# Altium project Wireless_Security_Detection.PrjPcb (part 2 of 3)

## Sheet Microcontroller.SchDoc
size A3; SheetNumber: 3; SheetTotal: 4; Size: A3
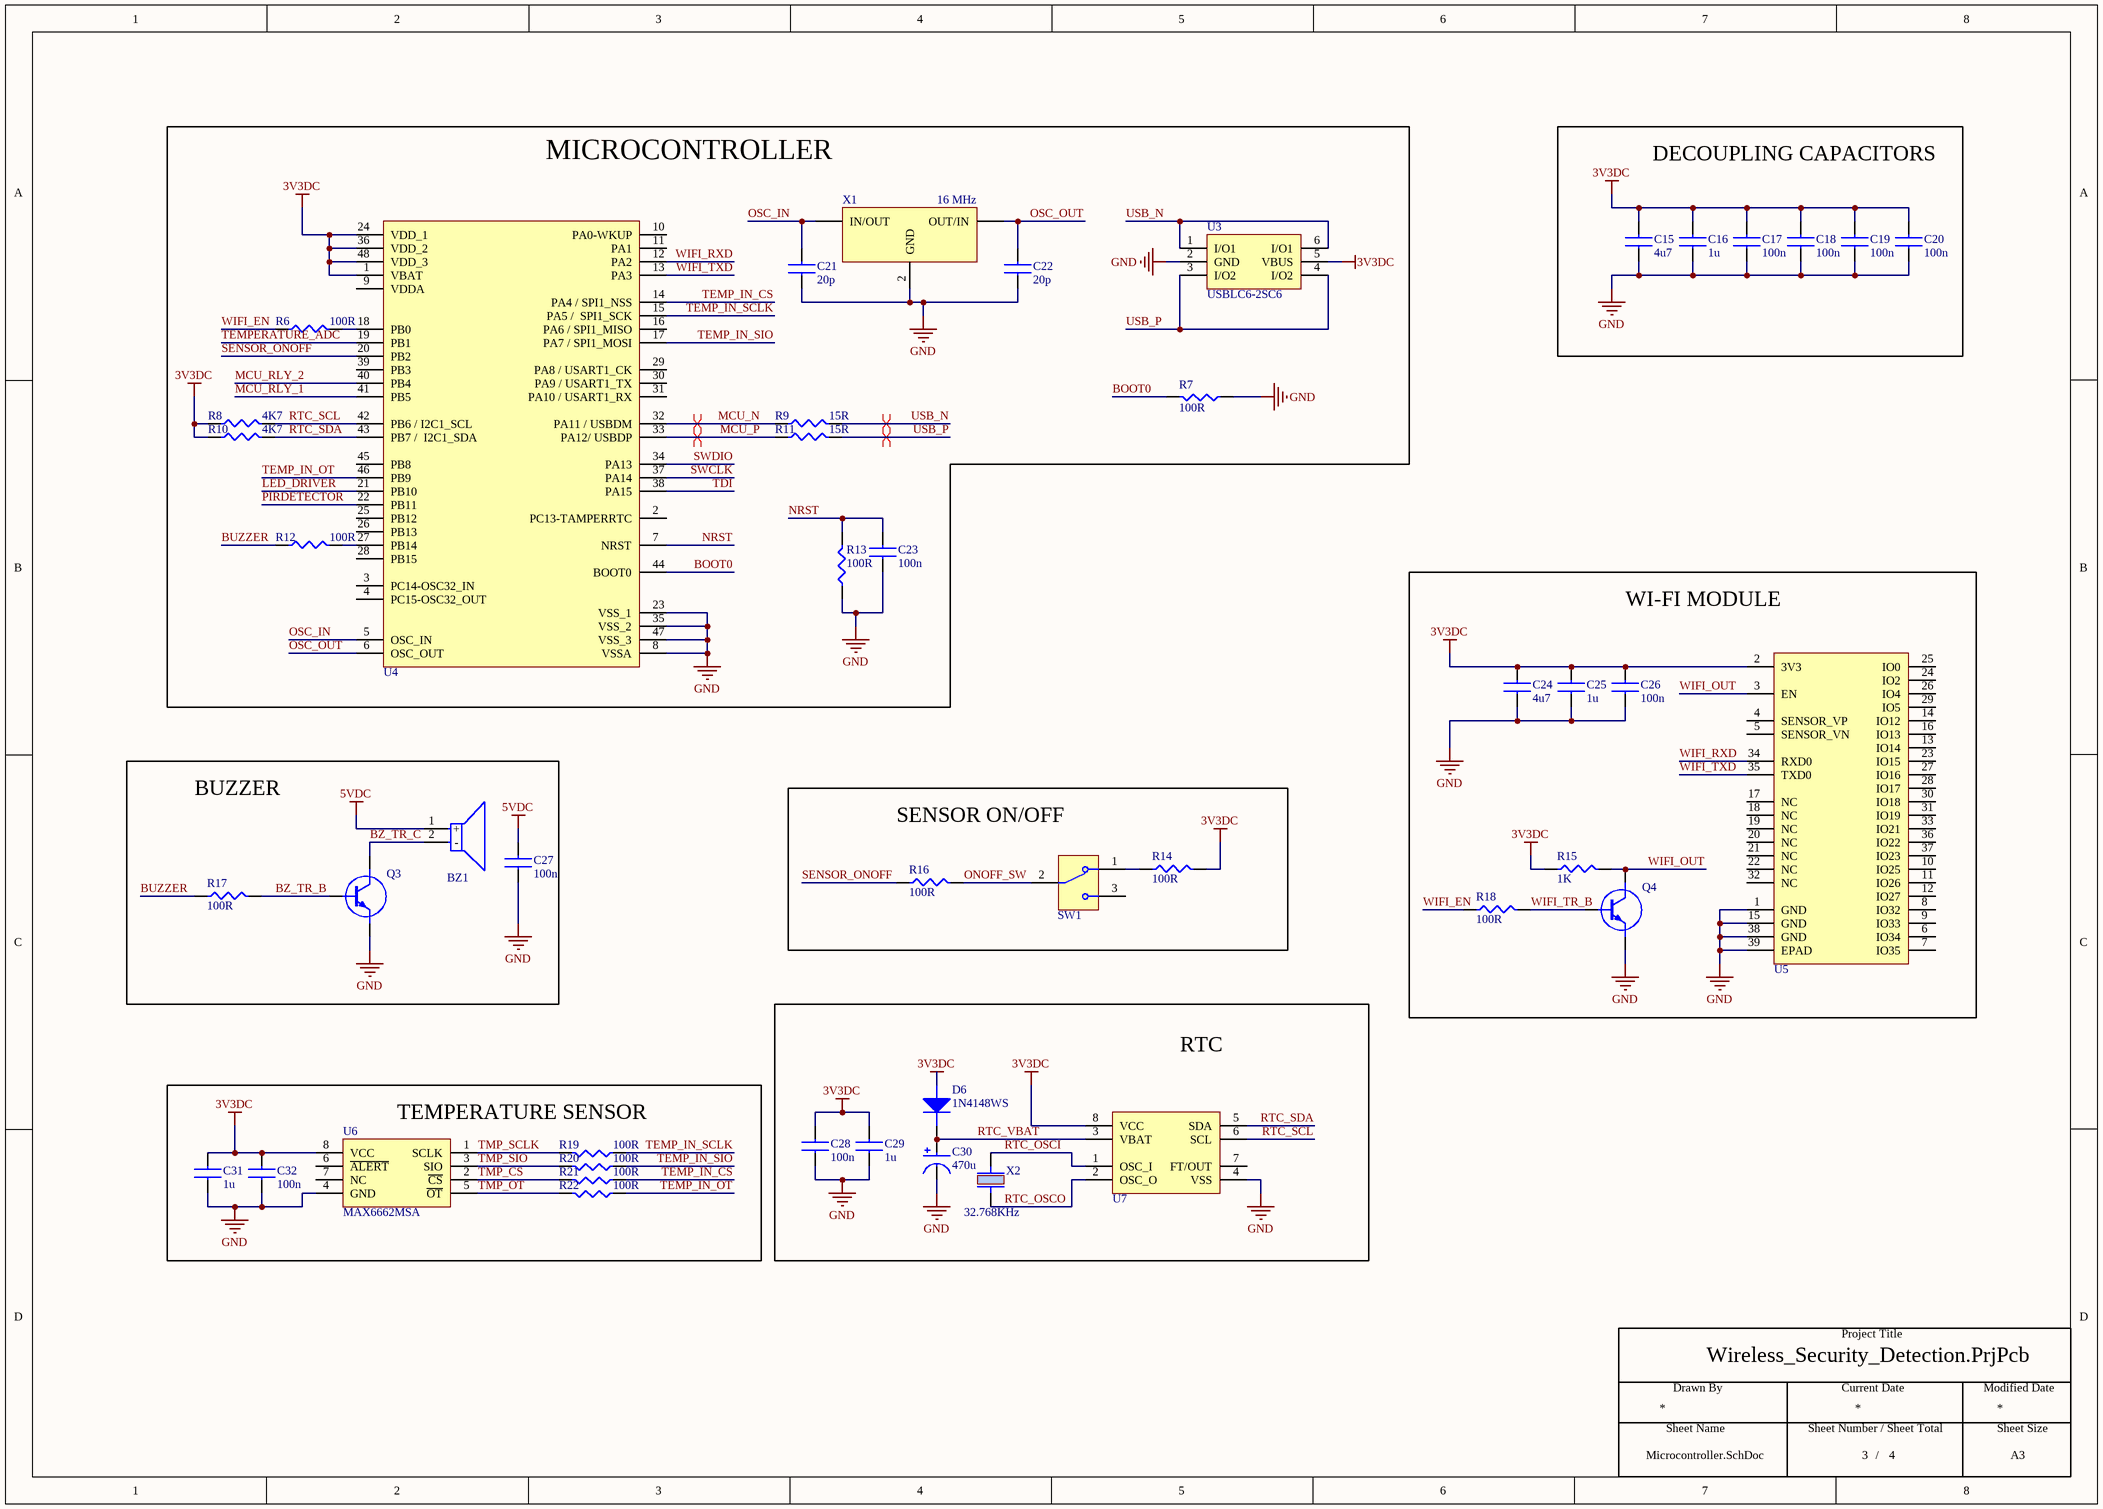
[diagram p2: Microcontroller.SchDoc]

### Parts
BZ1  CMI-9605IC-0580T  [CMI-9605IC-0580T]  (value not drawn)
C15  4u7  [CAPACITOR 0805 - duplicate]
C16  1u  [CAPACITOR 0805 - duplicate]
C17  100n  [Capacitor 0603]
C18  100n  [Capacitor 0603]
C19  100n  [Capacitor 0603]
C20  100n  [Capacitor 0603]
C21  20p  [CAPACITOR 0603]
C22  20p  [CAPACITOR 0603]
C23  100n  [CAPACITOR 0805 - duplicate]
C24  4u7  [CAPACITOR 0805 - duplicate]
C25  1u  [CAPACITOR 0805 - duplicate]
C26  100n  [CAPACITOR 0805 - duplicate]
C27  100n  [CAPACITOR 0805 - duplicate]
C28  100n  [CAPACITOR 0805 - duplicate]
C29  1u  [CAPACITOR 0805 - duplicate]
C30  470u  [CAP ALUM RADIAL TH D10 L20 P5]
C31  1u  [CAPACITOR 0805 - duplicate]
C32  100n  [CAPACITOR 0805 - duplicate]
D6  1N4148WS  [SOD-323F]
Q3  MMBT3904-7-F  [SOT-23F]  (value not drawn)
Q4  MMBT3904-7-F  [SOT-23F]  (value not drawn)
R6  100R  [Resistor 0603]
R7  100R  [Resistor 0603]
R8  4K7  [Resistor 0603]
R9  15R  [Resistor 0603]
R10  4K7  [Resistor 0603]
R11  15R  [Resistor 0603]
R12  100R  [Resistor 0603]
R13  100R  [Resistor 0603]
R14  100R  [Resistor 0603]
R15  1K  [Resistor 0603]
R16  100R  [Resistor 0603]
R17  100R  [Resistor 0603]
R18  100R  [Resistor 0603]
R19  100R  [Resistor 0603]
R20  100R  [Resistor 0603]
R21  100R  [Resistor 0603]
R22  100R  [Resistor 0603]
SW1  EG1215AA  [EG1215AA]  (value not drawn)
U3  USBLC6-2SC6  [SOT23-6L]
U4  STM32F103C6T6A  [LQFP48]  (value not drawn)
U5  ESP32-WROOM-32E  [ESP32­WROOM­32E]  (value not drawn)
U6  MAX6662MSA  [SOIC-8]
U7  M41T00M6F  [SOIC-8]  (value not drawn)
X1  16 MHz  [ECS-160-20-30B-TR 16MHZ]
X2  32.768KHz  [ABS05-32.768KHZ-T]

### Blocks framed on the sheet
MICROCONTROLLER: C21-C23 R6-R13 U3 U4 X1
DECOUPLING CAPACITORS: C15-C20
WI-FI MODULE: C24-C26 Q4 R15 R18 U5
BUZZER: BZ1 C27 Q3 R17
SENSOR ON/OFF: R14 R16 SW1
RTC: C28-C30 D6 U7 X2
TEMPERATURE SENSOR: C31 C32 R19-R22 U6

### Nets
3V3DC: C15.2 C16.2 C17.2 C18.2 C19.2 C20.2 C24.2 C25.2 C26.2 C28.2 C29.2 C31.2 C32.2 D6.1(A) R8.1 R10.1 R14.2 R15.1 U3.5(VBUS) U4.1(VBAT) U4.24(VDD_1) U4.36(VDD_2) U4.48(VDD_3) U5.2(3V3) U6.8(VCC) U7.8(VCC)
5VDC: BZ1.1(+) C27.2
GND: C15.1 C16.1 C17.1 C18.1 C19.1 C20.1 C21.1 C22.1 C23.1 C24.1 C25.1 C26.1 C27.1 C28.1 C29.1 C30.2 C31.1 C32.1 Q3.2(E) Q4.2(E) R7.1 R13.1 U3.2(GND) U4.8(VSSA) U4.23(VSS_1) U4.35(VSS_2) U4.47(VSS_3) U5.1(GND) U5.15(GND) U5.38(GND) U5.39(EPAD) U6.4(GND) U7.4(VSS) X1.2(GND)
BOOT0: R7.2 U4.44(BOOT0)
BUZZER: R12.1 R17.1
BZ_TR_B: Q3.1(B) R17.2
BZ_TR_C: BZ1.2(-) Q3.3(C)
LED_DRIVER: U4.21(PB10)
MCU_N: R9.1 U4.32(PA11_/_USBDM)
MCU_P: R11.1 U4.33(PA12/_USBDP)
MCU_RLY_1: U4.41(PB5)
MCU_RLY_2: U4.40(PB4)
NRST: C23.2 R13.2 U4.7(NRST)
ONOFF_SW: R16.2 SW1.2
OSC_IN: C21.2 U4.5(OSC_IN) X1.1(IN/OUT)
OSC_OUT: C22.2 U4.6(OSC_OUT) X1.3(OUT/IN)
PIRDETECTOR: U4.22(PB11)
RTC_OSCI: U7.1(OSC_I) X2.2
RTC_OSCO: U7.2(OSC_O) X2.1
RTC_SCL: R8.2 U4.42(PB6_/_I2C1_SCL) U7.6(SCL)
RTC_SDA: R10.2 U4.43(PB7_/__I2C1_SDA) U7.5(SDA)
RTC_VBAT: C30.1 D6.2(C) U7.3(VBAT)
SENSOR_ONOFF: R16.1 U4.20(PB2)
SWCLK: U4.37(PA14)
SWDIO: U4.34(PA13)
TDI: U4.38(PA15)
TEMP_IN_CS: R21.1 U4.14(PA4_/_SPI1_NSS)
TEMP_IN_OT: R22.1 U4.46(PB9)
TEMP_IN_SCLK: R19.1 U4.15(PA5_/__SPI1_SCK)
TEMP_IN_SIO: R20.1 U4.17(PA7_/_SPI1_MOSI)
TEMPERATURE_ADC: U4.19(PB1)
TMP_CS: R21.2 U6.2(~{CS})
TMP_OT: R22.2 U6.5(~{OT})
TMP_SCLK: R19.2 U6.1(SCLK)
TMP_SIO: R20.2 U6.3(SIO)
USB_N: R9.2 U3.1(I/O1) U3.6(I/O1)
USB_P: R11.2 U3.3(I/O2) U3.4(I/O2)
WIFI_EN: R6.1 R18.1
WIFI_OUT: Q4.3(C) R15.2 U5.3(EN)
WIFI_RXD: U4.12(PA2) U5.34(RXD0)
WIFI_TR_B: Q4.1(B) R18.2
WIFI_TXD: U4.13(PA3) U5.35(TXD0)
NetR6_2: R6.2 U4.18(PB0)
NetR12_2: R12.2 U4.27(PB14)
NetR14_1: R14.1 SW1.1

Not connected (* = marked no-connect by the designer): SW1 3; U4 2(PC13-TAMPERRTC) 3(PC14-OSC32_IN) 4(PC15-OSC32_OUT) 9(VDDA) 10(PA0-WKUP) 11(PA1) 16(PA6_/_SPI1_MISO) 25(PB12) 26(PB13) 28(PB15) 29(PA8_/_USART1_CK) 30(PA9_/_USART1_TX) 31(PA10_/_USART1_RX) 39(PB3) 45(PB8); U5 4(SENSOR_VP) 5(SENSOR_VN) 6(IO34) 7(IO35) 8(IO32) 9(IO33) 10(IO25) 11(IO26) 12(IO27) 13(IO14) 14(IO12) 16(IO13) 17(NC) 18(NC) 19(NC) 20(NC) 21(NC) 22(NC) 23(IO15) 24(IO2) 25(IO0) 26(IO4) 27(IO16) 28(IO17) 29(IO5) 30(IO18) 31(IO19) 32(NC) 33(IO21) 36(IO22) 37(IO23); U6 6(~{ALERT}) 7(NC); U7 7(FT/OUT)

### Layout directives
differential pair: MCU_N, MCU_P, USB_N, USB_P

### Notes on the sheet
- Drawn By
- Project Title
- Current Date
- Modified Date
- Sheet Name
- Sheet Number / Sheet Total
- /
- Sheet Size

### Library data of the parts
BZ1 = CMI-9605IC-0580T: Audio Buzzer Magnetic 3VDC 7VDC 30mA 5VDC 85dB 2600Hz to 2800Hz Through Hole Pin Box; Manufacturer: CUI Devices; Shape: 4456Shape; Designed by: UK; Supplier: Digikey; Supplier Part Number: 2223-CMI-9605IC-0580T-ND; Manufacturer Part Number: CMI-9605IC-0580T; RoHS: No; Category: Audio Products; Stock: 5278; Pricing: 1=1, 10=0.837, 25=0.7744, 50=0.7312 (USD); Length: 9.6mm; Width: 9.6mm; Height: 5mm
C15 C24 = CAP CER 4.7uF 0805: Multilayer Ceramic Capacitor, 4.7 uF, 25 V, ± 10%, X5R, 0805 [2012 Metric]; Manufacturer: Samsung; Manufacturer Part Number: CL21A475KAQNNNE; Designed by: UK; Value: 4.7uF; Voltage Rating: 25V; Supplier: Digikey; Supplier Part Number: 1276-1244-2-ND; RoHS: Yes; Category: Ceramic Capacitors; Stock: 3213374; Pricing: 2000=0.01305, 4000=0.01194, 10000=0.0111, 14000=0.01055, 50000=0.00978 (USD); Mounting Technology: Surface Mount; Case/Package: 0805; Case Code (Metric): 2012; Case Code (Imperial): 0805; Material: Ceramic; Min Operating Temperature: -55°C; Max Operating Temperature: 85°C; Packaging: Tape and Reel; Tolerance: 10%; Dielectric: X5R; Voltage Rating (DC): 25V; Series: CL; Construction: Flat; Length: 2mm; Height: 1.25mm; Depth: 1.25mm; Radiation Hardening: No; Lead Free: Lead Free; RoHS Compliant: Yes; ComponentLink1URL: https://datasheet.ciiva.com/25798/cl21a475kaqnnne-25798882.pdf?src-supplier=Digikey; ComponentLink1Description: https://datasheet.ciiva.com/25798/cl21a475kaqnnne-25798882.pdf?src-supplier=Digikey
C16 C25 C29 C31 = CAP CER 1uF 0805: Multilayer Ceramic Capacitor, 1 uF, 50 V, ± 10%, X7R, 0805 [2012 Metric]; Manufacturer: Samsung; Manufacturer Part Number: CL21B105KBFNNNE; Designed by: UK; Voltage Rating (DC): 50V; Value: 1uF; Supplier: Digikey; Supplier Part Number: 1276-1029-2-ND; RoHS: Yes; Category: Ceramic Capacitors; Stock: 1265790; Pricing: 2000=0.02015, 4000=0.01844, 10000=0.01715, 14000=0.01629, 50000=0.01415, 100000=0.01169, 200000=0.0114 (USD); Mounting Technology: Surface Mount; Case/Package: 0805; Material: Ceramic; Case Code (Metric): 2012; Case Code (Imperial): 0805; Min Operating Temperature: -55°C; Max Operating Temperature: 125°C; Tolerance: 10%; Packaging: Tape and Reel; Package Quantity: 1; Voltage Rating: 50V; Dielectric: X7R; Voltage: 50V; Series: CL; Construction: Flat; Length: 2mm; Width: 0.049inch; Height: 1.25mm; Thickness: 0.053inch; Depth: 1.25mm; Radiation Hardening: No; RoHS Compliant: Yes; ComponentLink1URL: https://datasheet.ciiva.com/25800/cl21b105kbfnnne-25800291.pdf?src-supplier=Digikey; ComponentLink1Description: https://datasheet.ciiva.com/25800/cl21b105kbfnnne-25800291.pdf?src-supplier=Digikey
C17-C20 = CAP CER 100nF 0603: Multilayer Ceramic Capacitor, 0.1 uF, 50 V, ± 10%, X7R, 0603 [1608 Metric]; Manufacturer: KEMET; Manufacturer Part Number: C0603C104K5RACTU; Material: 4241ConductorMaterial; Value: 100nF; Voltage Rating: 50V; Temperature Coefficient: 30ppm/°C; Designed by: UK; Supplier: Digikey; Supplier Part Number: 399-C0603C104K5RAC7867TR-ND; RoHS: Yes; Category: Ceramic Capacitors; Stock: 3063153; Pricing: 4000=0.01394, 8000=0.01273, 12000=0.01212, 28000=0.01151, 100000=0.00833, 200000=0.00806, 400000=0.00758 (USD); Mounting Technology: Surface Mount; Case/Package: 0603; Min Operating Temperature: -55°C; Max Operating Temperature: 125°C; Tolerance: 10%; Dielectric: X7R; Packaging: Tape and Reel; Voltage: 50V; Series: SMD Comm X7R; Length: 0.063inch; Width: 0.031inch; Thickness: 0.034inch; RoHS Compliant: Yes; Lead Free: 5697LeadFree
C21 C22 = CAP CER 20pF 0603: Multilayer Ceramic Capacitor, 20 pF, 50 V, ± 5%, C0G (NP0), 0603 [1608 Metric]; Manufacturer: Samsung; Manufacturer Part Number: CL10C200JB8NNNC; Designed by: UK; Voltage Rating (DC): 50V; Supplier: Digikey; Supplier Part Number: 1276-1187-2-ND; RoHS: Yes; Category: Ceramic Capacitors; Stock: 296000; Pricing: 4000=0.00911, 8000=0.00831, 12000=0.00792, 28000=0.00752, 100000=0.00544, 200000=0.00527, 400000=0.00495 (USD); ComponentLink1URL: https://datasheet.ciiva.com/26877/getdatasheetpartid-640634-26877974.pdf?src-supplier=Verical; ComponentLink1Description: https://datasheet.ciiva.com/26877/getdatasheetpartid-640634-26877974.pdf?src-supplier=Verical; ComponentLink2URL: https://datasheet.ciiva.com/26310/mlcc-catalogdownload2013-eng-26310315.pdf?src-supplier=Distrelec; ComponentLink2Description: https://datasheet.ciiva.com/26310/mlcc-catalogdownload2013-eng-26310315.pdf?src-supplier=Distrelec
C23 C26-C28 C32 = CAP CER 100nF 0805: Multilayer Ceramic Capacitor, 0.1 uF, 50 V, ± 10%, X7R, 0805 [2012 Metric]; Manufacturer: Samsung; Manufacturer Part Number: CL21B104KBCNNNC; Value: 100nF; Voltage Rating: 50V; Designed by: UK; Supplier: Digikey; Supplier Part Number: 1276-1003-6-ND; RoHS: Yes; Category: Ceramic Capacitors; Stock: 1751530; Pricing: 1=0.1, 10=0.042, 50=0.024, 100=0.0186, 500=0.01404, 1000=0.01103 (USD); Mounting Technology: Surface Mount; Case/Package: 0805; Case Code (Metric): 2012; Case Code (Imperial): 0805; Material: Ceramic; Min Operating Temperature: -55°C; Max Operating Temperature: 125°C; Tolerance: 10%; Dielectric: X7R; Packaging: Tape and Reel; Voltage: 50V; Series: CL; Construction: Flat; Voltage Rating (DC): 50V; Length: 2mm; Width: 0.049inch; Height: 0.85mm; Depth: 1.25mm; Thickness: 0.037inch; Radiation Hardening: No; RoHS Compliant: Yes; Lead Free: 5697LeadFree; ComponentLink1URL: https://datasheet.ciiva.com/25710/cl21b104kbcnnnc-25710182.pdf?src-supplier=Digikey; ComponentLink1Description: https://datasheet.ciiva.com/25710/cl21b104kbcnnnc-25710182.pdf?src-supplier=Digikey; ComponentLink2URL: https://datasheet.ciiva.com/29199/454152-da-01-en-vs-kondensator-0805-29199814.pdf?src-supplier=Conrad; ComponentLink2Description: https://datasheet.ciiva.com/29199/454152-da-01-en-vs-kondensator-0805-29199814.pdf?src-supplier=Conrad
C30 = CAP ALUM 470uF RADIAL TH: Radial Electrolytic Aluminium Capacitor, 470uF, 50VDC, 20%; Manufacturer: KEMET; Manufacturer Part Number: ESH477M050AH4AA; Designed by: UK; Voltage Rating (DC): 50V; Supplier: Digikey; Supplier Part Number: 399-15683-ND; RoHS: Yes; Category: LDO; Stock: 10333; Pricing: 1=0.64, 10=0.432, 200=0.28415, 1000=0.1887, 5000=0.1665, 10000=0.1554 (USD); Diameter: 10mm; Height: 20mm; ComponentLink1URL: https://api.kemet.com/component-edge/download/datasheet/ESH477M050AH4AA.pdf?src-supplier=Digikey; ComponentLink1Description: https://api.kemet.com/component-edge/download/datasheet/ESH477M050AH4AA.pdf?src-supplier=Digikey; ComponentLink2URL: https://datasheet.octopart.com/ESH477M050AH4AA-KEMET-datasheet-130075338.pdf?src-supplier=Newark; ComponentLink2Description: https://datasheet.octopart.com/ESH477M050AH4AA-KEMET-datasheet-130075338.pdf?src-supplier=Newark
D6 = 1N4148WS: Diode Ultra Fast Recovery Rectifier 75V 0.15A 2-Pin SOD-323F T/R; Manufacturer: ON Semiconductor / Fairchild; Designed by: UK; Max Reverse Current: 5uA; Max Forward Surge Current (Ifsm): 2A; Value: 4pF; Forward Current: 150mA; Reverse Recovery Time: 4ns; Element Configuration: Single; Supplier: Digikey; Supplier Part Number: 1N4148WSFSDKR-ND; Manufacturer Part Number: 1N4148WS; RoHS: Yes; Category: Rectifier Diodes; Stock: 620002; Pricing: 1=0.19, 10=0.136, 100=0.0733, 500=0.0576, 1000=0.04 (USD); Mounting Technology: Surface Mount; Pins: 2; Weight: 0.0276g; Min Operating Temperature: -55°C; Max Operating Temperature: 150°C; Reverse Voltage: 75V; Average Rectified Current: 150mA; Max Repetitive Reverse Voltage (Vrrm): 75V; Max Reverse Voltage (DC): 75V; Series: -; Packaging: Tape and Reel; Package Quantity: 1; Recovery Time: 4ns; Length: 1.8mm; Width: 1.35mm; Height: 1mm; Radiation Hardening: No; RoHS Compliant: Yes; Lead Free: Lead Free; Reach SVHC Compliant: No
Q3 Q4 = MMBT3904-7-F: Transistor General Purpose BJT NPN 40 Volt 0.2A Automotive 3-Pin SOT-23; Manufacturer: Diodes Zetex; Designed by: UK; Max Power Dissipation: 300mW; Collector Emitter Voltage (VCEO): 40V; Max Collector Current: 200mA; Collector Base Voltage (VCBO): 60V; Power Dissipation: 350mW; Frequency: 300MHz; hFE Min: 100; Number of Elements: 1; Emitter Base Voltage (VEBO): 6V; Collector Emitter Saturation Voltage: 300mV; Supplier: Digikey; Supplier Part Number: MMBT3904-FDICT-ND; Manufacturer Part Number: MMBT3904-7-F; RoHS: Yes; Category: BJTs; Stock: 4408549; Pricing: 1=0.12, 10=0.086, 100=0.0467, 500=0.03666, 1000=0.02545 (USD); Mounting Technology: Surface Mount; Case/Package: SOT-23; Pins: 3; Weight: 0.000282oz; Min Operating Temperature: -55°C; Max Operating Temperature: 150°C; Polarity: NPN; Packaging: Tape and Reel; Voltage Rating (DC): 40V; Package Quantity: 3000; Transition Frequency: 300MHz; Collector Emitter Breakdown Voltage: 40V; Max Breakdown Voltage: 40V; Continuous Collector Current: 200mA; Clock Frequency: 300MHz; Gain Bandwidth Product: 300MHz; Series: Automotive, AEC-Q101; Collector-emitter Voltage-Max: 300mV; Length: 3.05mm; Width: 1.4mm; Height: 1mm; Radiation Hardening: No; Reach SVHC Compliant: No; Lead Free: Lead Free; RoHS Compliant: Yes; ComponentLink1URL: https://datasheet.ciiva.com/11201/ds30036-11201778.pdf?src-supplier=Avnet; ComponentLink1Description: https://datasheet.ciiva.com/11201/ds30036-11201778.pdf?src-supplier=Avnet; ComponentLink2URL: https://datasheet.ciiva.com/15138/getdatasheetpartid-53265-15138780.pdf?src-supplier=Verical; ComponentLink2Description: https://datasheet.ciiva.com/15138/getdatasheetpartid-53265-15138780.pdf?src-supplier=Verical; ComponentLink3URL: https://datasheet.ciiva.com/22711/1915516-22711750.pdf?src-supplier=Element14; ComponentLink3Description: https://datasheet.ciiva.com/22711/1915516-22711750.pdf?src-supplier=Element14; ComponentLink4URL: https://datasheet.ciiva.com/11198/ds30036-11198999.pdf?src-supplier=Avnet; ComponentLink4Description: https://datasheet.ciiva.com/11198/ds30036-11198999.pdf?src-supplier=Avnet; ComponentLink5URL: https://datasheet.ciiva.com/6361/ds30036-6361256.pdf?src-supplier=Digikey; ComponentLink5Description: https://datasheet.ciiva.com/6361/ds30036-6361256.pdf?src-supplier=Digikey; ComponentLink6URL: https://datasheet.ciiva.com/6361/ds30036-6361254.pdf?src-supplier=Digikey; ComponentLink6Description: https://datasheet.ciiva.com/6361/ds30036-6361254.pdf?src-supplier=Digikey
R6 R7 R12-R14 R16-R22 = RES 100R 0603: SMD Chip Resistor, 100 Ohm, ± 5%, 100 mW, 0603 [1608 Metric], Thick Film, General Purpose; Manufacturer: Yageo; Manufacturer Part Number: RC0603JR-07100RL; Designed by: UK; Temperature Coefficient: 100ppm/°C; Voltage Rating (DC): 50V; Power Rating: 100mW; Supplier: Digikey; Supplier Part Number: 311-100GRDKR-ND; RoHS: Yes; Category: Chip SMD Resistors; Stock: 1088098; Pricing: 1=0.1, 10=0.015, 50=0.0092, 100=0.0076, 500=0.00512, 1000=0.00437 (USD); Case/Package: 0603; Pins: 2; Contact Plating: Tin,Matte; Case Code (Imperial): 0603; Case Code (Metric): 1608; Min Operating Temperature: -55°C; Max Operating Temperature: 155°C; Value: 100R; Tolerance: 5%; Resistor Type: Thick Film; Packaging: Tape and Reel; Voltage Rating: 50V; Termination: SMD/SMT; Features: Moisture Resistant; Series: RC; Max Power Dissipation: 100mW; Number of Terminations: 2; Construction: Rectangular; Resistance Tolerance: 5%; Voltage Rating (AC): 50V; Length: 1.6mm; Width: 0.8mm; Depth: 0.8mm; Lead Free: Lead Free; Reach SVHC Compliant: Unknown; Military Standard: Not; RoHS Compliant: Yes; ComponentLink1URL: https://datasheet.ciiva.com/7746/443971-7746425.pdf?src-supplier=Element14; ComponentLink1Description: https://datasheet.ciiva.com/7746/443971-7746425.pdf?src-supplier=Element14; ComponentLink2URL: https://datasheet.ciiva.com/7746/443971-7746426.pdf?src-supplier=Element14; ComponentLink2Description: https://datasheet.ciiva.com/7746/443971-7746426.pdf?src-supplier=Element14; ComponentLink3URL: https://datasheet.ciiva.com/8883/pyu-rc0603-51-rohs-l-4-8883047.pdf?src-supplier=Avnet; ComponentLink3Description: https://datasheet.ciiva.com/8883/pyu-rc0603-51-rohs-l-4-8883047.pdf?src-supplier=Avnet; ComponentLink4URL: https://datasheet.ciiva.com/15189/getdatasheetpartid-325207-15189846.pdf?src-supplier=Verical; ComponentLink4Description: https://datasheet.ciiva.com/15189/getdatasheetpartid-325207-15189846.pdf?src-supplier=Verical
R8 R10 = RES 4K7 0603: SMD Chip Resistor, 4.7 kOhm, ± 5%, 100 mW, 0603 [1608 Metric], Thick Film, General Purpose; Manufacturer: Yageo; Manufacturer Part Number: RC0603JR-074K7L; Designed by: UK; Voltage Rating (DC): 50V; Value: 4.7kR; Temperature Coefficient: 100ppm/°C; Power Rating: 100mW; Supplier: Digikey; Supplier Part Number: 311-4.7KGRCT-ND; RoHS: Yes; Category: Chip SMD Resistors; Stock: 4706238; Pricing: 1=0.1, 10=0.015, 50=0.0092, 100=0.0076, 500=0.00512, 1000=0.00437 (USD); Case/Package: 0603; Pins: 2; Case Code (Imperial): 0603; Case Code (Metric): 1608; Min Operating Temperature: -55°C; Max Operating Temperature: 155°C; Resistor Type: Thick Film; Tolerance: 5%; Voltage Rating: 50V; Packaging: Tape and Reel; Termination: SMD/SMT; Features: Moisture Resistant; Max Power Dissipation: 100mW; Number of Terminations: 2; Series: RC; Resistance Tolerance: 5%; Construction: Rectangular; Voltage Rating (AC): 50V; Length: 1.6mm; Width: 0.8mm; Depth: 0.8mm; Reach SVHC Compliant: No; RoHS Compliant: Yes; Lead Free: 5697LeadFree; Military Standard: Not; ComponentLink1URL: https://datasheet.ciiva.com/46412/443971-46412858.pdf?src-supplier=Element14; ComponentLink1Description: https://datasheet.ciiva.com/46412/443971-46412858.pdf?src-supplier=Element14
R9 R11 = RES 15R 0603: SMD Chip Resistor, 15 Ohm, ± 5%, 100 mW, 0603 [1608 Metric], Thick Film, General Purpose; Manufacturer: Yageo; Manufacturer Part Number: RC0603JR-0715RL; Designed by: UK; Voltage Rating (AC): 50V; Supplier: Digikey; Supplier Part Number: 311-15GRTR-ND; RoHS: Yes; Category: Chip SMD Resistors; Stock: 105000; Pricing: 5000=0.00314, 10000=0.00275, 25000=0.00236, 35000=0.00228, 50000=0.00211, 125000=0.00191 (USD); ComponentLink1URL: https://datasheet.ciiva.com/2453/pyu-r-int-thick-7-2453085.pdf?src-supplier=Digikey; ComponentLink1Description: https://datasheet.ciiva.com/2453/pyu-r-int-thick-7-2453085.pdf?src-supplier=Digikey; ComponentLink2URL: https://datasheet.ciiva.com/2453/pyu-r-int-thick-7-2453086.pdf?src-supplier=Digikey; ComponentLink2Description: https://datasheet.ciiva.com/2453/pyu-r-int-thick-7-2453086.pdf?src-supplier=Digikey; ComponentLink3URL: https://datasheet.ciiva.com/2453/pyu-r-int-thick-7-2453087.pdf?src-supplier=Digikey; ComponentLink3Description: https://datasheet.ciiva.com/2453/pyu-r-int-thick-7-2453087.pdf?src-supplier=Digikey; ComponentLink4URL: https://datasheet.ciiva.com/7746/443971-7746445.pdf?src-supplier=Element14; ComponentLink4Description: https://datasheet.ciiva.com/7746/443971-7746445.pdf?src-supplier=Element14; ComponentLink5URL: https://datasheet.ciiva.com/7746/443971-7746446.pdf?src-supplier=Element14; ComponentLink5Description: https://datasheet.ciiva.com/7746/443971-7746446.pdf?src-supplier=Element14
R15 = RES 1K 0603: SMD Chip Resistor, 1 kOhm, ± 1%, 100 mW, 0603 [1608 Metric], Thick Film, General Purpose; Manufacturer: Yageo; Manufacturer Part Number: RC0603FR-071KL; Designed by: UK; Value: 1kR; Temperature Coefficient: 100ppm/°C; Power Rating: 100mW; Voltage Rating: 50V; Supplier: Digikey; Supplier Part Number: 311-1.00KHRCT-ND; RoHS: Yes; Category: Chip SMD Resistors; Stock: 12285830; Pricing: 1=0.1, 10=0.019, 50=0.0112, 100=0.0093, 500=0.00622, 1000=0.00532 (USD); Case/Package: 0603; Contact Plating: Tin,Matte; Case Code (Imperial): 0603; Case Code (Metric): 1608; Min Operating Temperature: -55°C; Max Operating Temperature: 155°C; Tolerance: 1%; Resistor Type: Thick Film; Packaging: Tape and Reel; Termination: SMD/SMT; Features: Moisture Resistant; Series: RC; Max Power Dissipation: 100mW; Number of Terminations: 2; Technology: THICK FILM; Resistance Tolerance: 1%; Construction: Rectangular; Length: 1.6mm; Height: 0.45mm; Depth: 0.8mm; Reach SVHC Compliant: No; Lead Free: 5697LeadFree; Military Standard: Not; RoHS Compliant: Yes
SW1 = EG1215AA: Slide Switch, SPDT, 0.025A, 24V, SMD; Manufacturer: E-Switch; Mechanical Life: 10000Cycles; Switch Function: On-On; Actuator Type: Standard; Switch Travel: 1.5mm; Operating Force: 150gf; Actuator Length: 1.4mm; Designed by: UK; Supplier: Digikey; Supplier Part Number: EG5720CT-ND; Manufacturer Part Number: EG1215AA; RoHS: Yes; Stock: 20364; Pricing: 1=0.99, 10=0.951, 25=0.8884, 100=0.7715, 250=0.702, 500=0.6508, 1000=0.60327 (USD); Mounting Technology: Surface Mount; Min Operating Temperature: -20°C; Max Operating Temperature: 70°C; Throw Configuration: SPDT; Packaging: Cut Tape; Voltage Rating (DC): 24V; Termination: Gull Wing; Electrical Life: 10000Cycles; Series: EG; RoHS Compliant: Yes; ComponentLink1URL: https://media.digikey.com/pdf/Data%20Sheets/E-Switch%20PDFs/EG1215_Series_Ds.pdf?src-supplier=Digikey; ComponentLink1Description: https://media.digikey.com/pdf/Data%20Sheets/E-Switch%20PDFs/EG1215_Series_Ds.pdf?src-supplier=Digikey; ComponentLink2URL: http://www.farnell.com/datasheets/2645007.pdf?src-supplier=Farnell; ComponentLink2Description: http://www.farnell.com/datasheets/2645007.pdf?src-supplier=Farnell
U3 = USBLC6-2SC6: ESD Suppressor Diode Arrays Uni-Dir 15kV@Air Gap/8kV@Contact Disc 6-Pin SOT-23 T/R; Manufacturer: STMicroelectronics; Designed by: UK; Direction: Unidirectional,Bidirectional; Value: 3.5pF; Operating Supply Voltage: 1.1V; Number of Channels: 2; Breakdown Voltage: 6V; Clamping Voltage: 17V; Reverse Standoff Voltage: 5.25V; Power Line Protection: Yes; Test Current: 1mA; Max Reverse Leakage Current: 150nA; Peak Pulse Current: 5A; Data Rate: 480Mbps; Number of Elements: 1; Working Voltage: 5V; Supplier: Digikey; Supplier Part Number: 497-5235-6-ND; Manufacturer Part Number: USBLC6-2SC6; RoHS: Yes; Category: TVS Diodes; Stock: 19244; Pricing: 1=0.35, 10=0.273, 100=0.1636, 500=0.1515, 1000=0.10302 (USD); Mounting Technology: Surface Mount; Case/Package: SOT-23; Pins: 6; Min Operating Temperature: -40°C; Max Operating Temperature: 125°C; Packaging: Tape and Reel; Package Quantity: 3000; Termination: SMD/SMT; Number of Bidirectional Channels: 2; Min Breakdown Voltage: 6V; ESD Protection: Yes; Leakage Current: 150nA; Series: USB; Reverse Breakdown Voltage: 6V; Polarity: Unidirectional,Bidirectional; Max Breakdown Voltage: 6V; Clamping Voltage-Max: 17V; Max Repetitive Reverse Voltage (Vrrm): 5.25V; Length: 3.05mm; Width: 1.75mm; Height: 1.3mm; Depth: 1.75mm; Radiation Hardening: No; Lead Free: Lead Free; Reach SVHC Compliant: No; RoHS Compliant: Yes; ComponentLink1URL: https://datasheet.ciiva.com/1268/1690354-1268384.pdf?src-supplier=Element14; ComponentLink1Description: https://datasheet.ciiva.com/1268/1690354-1268384.pdf?src-supplier=Element14; ComponentLink2URL: https://datasheet.ciiva.com/4508/cd00050750-113117-4508433.pdf?src-supplier=Mouser; ComponentLink2Description: https://datasheet.ciiva.com/4508/cd00050750-113117-4508433.pdf?src-supplier=Mouser; ComponentLink3URL: https://datasheet.ciiva.com/15143/getdatasheetpartid-148465-15143789.pdf?src-supplier=Verical; ComponentLink3Description: https://datasheet.ciiva.com/15143/getdatasheetpartid-148465-15143789.pdf?src-supplier=Verical; ComponentLink4URL: https://datasheet.ciiva.com/16200/cd00050750-16200026.pdf?src-supplier=Future+Electronics; ComponentLink4Description: https://datasheet.ciiva.com/16200/cd00050750-16200026.pdf?src-supplier=Future+Electronics; ComponentLink5URL: https://datasheet.ciiva.com/41444/001184109-da-01-en-ic-esd-protecti-usblc6-2sc6-sot-23-6-stm-41444156.pdf?src-supplier=Conrad; ComponentLink5Description: https://datasheet.ciiva.com/41444/001184109-da-01-en-ic-esd-protecti-usblc6-2sc6-sot-23-6-stm-41444156.pdf?src-supplier=Conrad
U4 = STM32F103C6T6A: MCU 32-bit STM32F ARM Cortex M3 RISC 32KB Flash 2.5V/3.3V 48-Pin LQFP Tray; Manufacturer: STMicroelectronics; Number of Timers/Counters: 3; Max Supply Voltage: 3.6V; Interface: I2C,SPI,USART; RAM Size: 10KB; Number of I/Os: 37; Min Supply Voltage: 2V; Data Bus Width: 32b; Clock Frequency: 72MHz; Number of ADC Channels: 10; Designed by: UK; Supplier: Digikey; Supplier Part Number: 497-11515-ND; Manufacturer Part Number: STM32F103C6T6A; RoHS: Yes; Category: Microcontrollers; Stock: 990; Pricing: 1=6.07, 10=5.453, 25=5.1552, 80=4.46775, 250=4.23868, 500=3.80336, 1000=3.20766, 2500=3.04728 (USD); Case/Package: LQFP; Pins: 48; Weight: 0.006409oz; Min Operating Temperature: -40°C; Max Operating Temperature: 85°C; Packaging: Tray; Series: STM32F103C6; Package Quantity: 1500; Memory Format: FLASH; Memory Size: 32KB; Core Architecture: ARM; Length: 7mm; Width: 7mm; Height: 1.4mm; Lead Free: Lead Free; RoHS Compliant: Yes; ComponentLink1URL: https://datasheet.ciiva.com/15122/getdatasheetpartid-69879-15122075.pdf?src-supplier=Verical; ComponentLink1Description: https://datasheet.ciiva.com/15122/getdatasheetpartid-69879-15122075.pdf?src-supplier=Verical; ComponentLink2URL: https://datasheet.ciiva.com/14100/pustm-arm-microcont-stm32f103-en-14100507.pdf?src-supplier=Distrelec; ComponentLink2Description: https://datasheet.ciiva.com/14100/pustm-arm-microcont-stm32f103-en-14100507.pdf?src-supplier=Distrelec
U5 = ESP32-WROOM-32E (4MB): WiFi-Module 802.11/BT 2, 4-2, 5GHz 150Mb/s; Manufacturer: Espressif Systems; Manufacturer Part Number: ESP32-WROOM-32E(M113EH3200PH3Q0); Interface: 39,40,1515,1518,1532Interface; Bandwidth: 72MHz; Data Rate: 150Mbps; Clock Frequency: 2.484GHz; Max Supply Voltage: 3.6V; Min Supply Voltage: 3V; Nominal Supply Current: 500mA; Number of ADC Channels: 16NUMBER; Number of GPIO: 26NUMBER; Designed by: UK; Supplier: Digikey; Supplier Part Number: 1965-ESP32-WROOM-32E-N4TR-ND; RoHS: No; Category: RF Receivers, Transceivers; Stock: 6640; Pricing: 650=2.5 (USD); Min Operating Temperature: -40°C; Max Operating Temperature: 85°C; Height: 3.25mm; ComponentLink1URL: https://www.espressif.com/sites/default/files/documentation/esp32-wroom-32e_esp32-wroom-32ue_datasheet_en.pdf; ComponentLink1Description: https://datasheet.octopart.com/ESP32-WROOM-32E-N4-Espressif-Systems-datasheet-165560559.pdf?src-supplier=TME
U6 = MAX6662MSA: Temp Sensor Digital Serial (3-Wire, SPI) 8-Pin SOIC N Tube; Manufacturer: Maxim; Manufacturer Part Number: MAX6662MSA+; Designed by: UK; Supplier: Digikey; Supplier Part Number: MAX6662MSA+-ND; RoHS: Yes; Category: Temperature and Humidity Sensors; Stock: 708; Pricing: 1=4.61, 10=3.454, 25=3.0704, 50=2.9168, 100=2.8401, 500=2.37956, 1000=2.22604 (USD); ComponentLink1URL: https://datasheet.ciiva.com/5299/max6662-89142-5299456.pdf?src-supplier=Mouser; ComponentLink1Description: https://datasheet.ciiva.com/5299/max6662-89142-5299456.pdf?src-supplier=Mouser; ComponentLink2URL: https://datasheet.ciiva.com/3277/max6662-3277979.pdf?src-supplier=Avnet; ComponentLink2Description: https://datasheet.ciiva.com/3277/max6662-3277979.pdf?src-supplier=Avnet; ComponentLink3URL: https://datasheet.ciiva.com/2003/max6662-2003390.pdf?src-supplier=Digikey; ComponentLink3Description: https://datasheet.ciiva.com/2003/max6662-2003390.pdf?src-supplier=Digikey
U7 = M41T00M6F: Real Time Clock (RTC) IC Clock/Calendar I2C, 2-Wire Serial 8-SOIC (0.154", 3.90mm Width); Manufacturer: STMicroelectronics; Designed by: UK; Supplier: Digikey; Supplier Part Number: 497-4697-1-ND; Manufacturer Part Number: M41T00M6F; RoHS: Yes; Category: Real Time Clocks; Stock: 20527; Pricing: 1=3.77, 10=3.388, 25=3.2032, 100=2.776, 250=2.63364, 500=2.36316, 1000=1.99303 (USD); ComponentLink1URL: https://datasheet.ciiva.com/7630/1837112-7630077.pdf?src-supplier=Element14; ComponentLink1Description: https://datasheet.ciiva.com/7630/1837112-7630077.pdf?src-supplier=Element14; ComponentLink2URL: https://datasheet.ciiva.com/16213/cd00001542-16213654.pdf?src-supplier=Future+Electronics; ComponentLink2Description: https://datasheet.ciiva.com/16213/cd00001542-16213654.pdf?src-supplier=Future+Electronics; ComponentLink3URL: https://datasheet.ciiva.com/41459/001185345-da-01-en-ic-rtc-srl-512kbit-m41t00m6f-soic-8-stm-41459818.pdf?src-supplier=Conrad; ComponentLink3Description: https://datasheet.ciiva.com/41459/001185345-da-01-en-ic-rtc-srl-512kbit-m41t00m6f-soic-8-stm-41459818.pdf?src-supplier=Conrad
X1 = ECS-160-20-30B-TR: Crystal 16MHz ±30ppm (Tol) ±50ppm (Stability) 20pF FUND 50Ohm 4-Pin Mini-SMD T/R; Manufacturer: ECS International; Designed by: UK; Supplier: Digikey; Supplier Part Number: XC1120DKR-ND; Manufacturer Part Number: ECS-160-20-30B-TR; RoHS: Yes; Category: Crystals; Stock: 8959; Pricing: 1=1.34, 10=1.281, 50=1.2514, 100=1.0726, 500=1.04282 (USD); ComponentLink1URL: https://datasheet.ciiva.com/853/ecx-53b-853408.pdf?src-supplier=Digikey; ComponentLink1Description: https://datasheet.ciiva.com/853/ecx-53b-853408.pdf?src-supplier=Digikey; ComponentLink2URL: https://datasheet.ciiva.com/853/ecx-53b-853407.pdf?src-supplier=Digikey; ComponentLink2Description: https://datasheet.ciiva.com/853/ecx-53b-853407.pdf?src-supplier=Digikey; ComponentLink3URL: https://datasheet.ciiva.com/853/ecx-53b-853406.pdf?src-supplier=Digikey; ComponentLink3Description: https://datasheet.ciiva.com/853/ecx-53b-853406.pdf?src-supplier=Digikey
X2 = ABS05-32.768KHZ-T: Crystal 32.768KHz ±20ppm (Tol) 12.5pF Flexural 90000Ohm 2-Pin CSMD T/R; Manufacturer: Abracon; Designed by: UK; ESR (Equivalent Series Resistance): 90kR; Supplier: Digikey; Supplier Part Number: 535-11899-6-ND; Manufacturer Part Number: ABS05-32.768KHZ-T; RoHS: Yes; Category: Crystals; Stock: 127282; Pricing: 1=0.75, 10=0.628, 50=0.565, 100=0.5022, 500=0.4771, 1000=0.40177 (USD); Mounting Technology: Surface Mount; Case/Package: CSMD; Pins: 2; Min Operating Temperature: -40°C; Max Operating Temperature: 85°C; Packaging: Tape and Reel; Frequency Tolerance: 20ppm; Load Capacitance: 12.5pF; Package Quantity: 3000; Frequency: 32.768kHz; Tolerance: 20ppm; Termination: SMD/SMT; ESR: 90kR; Series: ABS05; Operating Frequency: 32.768 kHz; Length: 1.6mm; Width: 1mm; Height: 0.5mm; Depth: 1mm; Radiation Hardening: No; Reach SVHC Compliant: No; Lead Free: Lead Free; RoHS Compliant: Yes; ComponentLink1URL: https://datasheet.ciiva.com/23810/abs05-23810480.pdf?src-supplier=Newark; ComponentLink1Description: https://datasheet.ciiva.com/23810/abs05-23810480.pdf?src-supplier=Newark; ComponentLink2URL: https://datasheet.ciiva.com/6728/abs05-6728949.pdf?src-supplier=Digikey; ComponentLink2Description: https://datasheet.ciiva.com/6728/abs05-6728949.pdf?src-supplier=Digikey; ComponentLink3URL: https://datasheet.ciiva.com/6728/abs05-6728950.pdf?src-supplier=Digikey; ComponentLink3Description: https://datasheet.ciiva.com/6728/abs05-6728950.pdf?src-supplier=Digikey; ComponentLink4URL: https://datasheet.ciiva.com/16411/abs05-16411149.pdf?src-supplier=Future+Electronics; ComponentLink4Description: https://datasheet.ciiva.com/16411/abs05-16411149.pdf?src-supplier=Future+Electronics